# Altium schematic sheet ControlRadio.SchDoc
size A
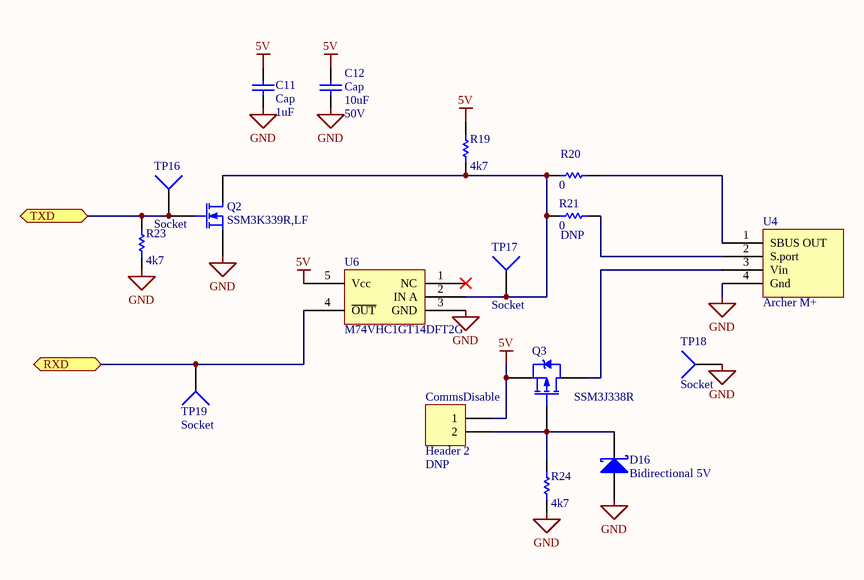
[diagram p0: ControlRadio.SchDoc]

## Parts
C11  Cap  value 1uF  [RESC3116X65N]
C12  Cap  value 10uF  Voltage Rating: 50V  [CAPC3216X180N]
CommsDisable  Header 2  [HDR1X2]
D16  Bidirectional 5V  [THRMC0603X33N]
Q2  SSM3K339R,LF  [SOT95P237X112-3N]
Q3  SSM3J338R  [SOT95P237X112-3N]
R19  value 4k7  [0402]  (hidden comment: Res1)
R20  value 0  [0402]  (hidden comment: Res1)
R21  value 0  [0402]  (hidden comment: Res1)
R23  value 4k7  [0402]  (hidden comment: Res1)
R24  value 4k7  [0402]  (hidden comment: Res1)
TP16  Socket  [5006]
TP17  Socket  [5006]
TP18  Socket  [5006]
TP19  Socket  [5006]
U4  Archer M+  [Archer M+]
U6  M74VHC1GT14DFT2G  [SOT65P210X110-5N]

## Ports
RXD, TXD

## Nets
5V: C11.2 C12.2 CommsDisable.1 Q3.2(S) R19.1 U6.5(Vcc)
GND: C11.1 C12.1 D16.3(A) Q2.2(S) R23.2 R24.2 TP18.1 U4.4(Gnd) U6.3(GND)
RXD: TP19.1 U6.4(~{OUT}) ; port RXD
TXD: Q2.1(G) R23.1 TP16.1 ; port TXD
NetCommsDisable_2: CommsDisable.2 D16.1(K) Q3.1(G) R24.1
NetQ2_3: Q2.3(D) R19.2 R20.1 R21.1 TP17.1 U6.2(IN_A)
NetQ3_3: Q3.3(D) U4.3(Vin)
NetR20_2: R20.2 U4.1(SBUS_OUT)
NetR21_2: R21.2 U4.2(S.port)

Not connected (* = marked no-connect by the designer): U6 1(NC)*

## Library data of the parts
C11 = Cap: Capacitor; Manufacturer Part Number: CL31B105KCHNNNE; Vendor Part Number: 1276-1838-1-ND
C12 = Cap: Capacitor; Manufacturer Part Number: CL31A106MBHNNNE; Vendor Part Number: 1276-6736-1-ND
CommsDisable = Header 2: Header, 2-Pin; LatestRevisionDate: 17-Jul-2002; LatestRevisionNote: Re-released for DXP Platform.; Publisher: Altium Limited; DNP: DNP
D16 = Diode 10TQ040: TVS; Manufacturer Part Number: CPDUC5V0R-HF; Vendor Part Number: 641-1764-1-ND
Q2 = MOSFET-N: N-Channel MOSFET; Vendor Part Number: SSM3K339RLFCT-ND; Manufacturer Part Number: SSM3K339R,LF
Q3 = PMOS-2: P-Channel Power MOSFET; Vendor Part Number: SSM3J338RLFCT-ND; Manufacturer Part Number: SSM3J338R
R19 R23 R24 = Res1: Resistor; Manufacturer Part Number: RC0402FR-074K7L; Vendor Part Number: 311-4.7KLRCT-ND; Tolerance: 1%
R20 R21 = Res1: Resistor; Manufacturer Part Number: RC0402FR-070RL; Vendor Part Number: 311-0.0LRCT-ND; Tolerance: 1%
  R20: DNP: *
  R21: DNP: DNP
TP16-TP19 = Socket: Vendor Part Number: 36-5006-ND; LatestRevisionDate: 17-Jul-2002; LatestRevisionNote: Re-released for DXP Platform.; Publisher: Altium Limited; Manufacturer Part Number: 5006
U4 = Archer M+: Vendor Part Number: Archer +
U6 = M74VHC1GT14DFT2G: Vendor Part Number: M74VHC1GT14DFT2GOSCT-ND; Manufacturer Part Number: M74VHC1GT14DFT2G